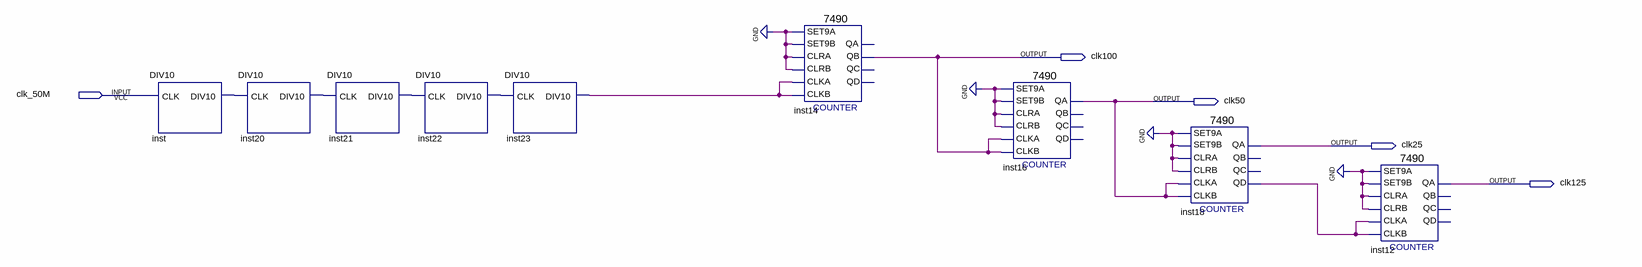
[diagram p0: schematic sheet]
// Quartus schematic DIV_SIM.bdf as structural Verilog: 9 symbols, 5 pins
module DIV_SIM (
  input  clk_50M,
  output clk100,
  output clk50,
  output clk25,
  output clk125
);

  wire inst18_qd, inst20_div10, inst21_div10, inst22_div10, inst23_div10, inst_div10;

  DIV10 inst (.CLK(clk_50M), .DIV10(inst_div10));
  DIV10 inst20 (.CLK(inst_div10), .DIV10(inst20_div10));
  DIV10 inst21 (.CLK(inst20_div10), .DIV10(inst21_div10));
  DIV10 inst22 (.CLK(inst21_div10), .DIV10(inst22_div10));
  DIV10 inst23 (.CLK(inst22_div10), .DIV10(inst23_div10));
  \7490  inst14 (
    .SET9A(1'b0), .CLRA(1'b0), .SET9B(1'b0), .CLKB(inst23_div10), .CLKA(inst23_div10), .CLRB(1'b0),
    .QB(clk100));  // open: QD, QA, QC
  \7490  inst16 (
    .SET9A(1'b0), .CLRA(1'b0), .SET9B(1'b0), .CLKB(clk100), .CLKA(clk100), .CLRB(1'b0), .QA(clk50));  // open: QD, QB, QC
  \7490  inst18 (
    .SET9A(1'b0), .CLRA(1'b0), .SET9B(1'b0), .CLKB(clk50), .CLKA(clk50), .CLRB(1'b0), .QD(inst18_qd),
    .QA(clk25));  // open: QB, QC
  \7490  inst12 (
    .SET9A(1'b0), .CLRA(1'b0), .SET9B(1'b0), .CLKB(inst18_qd), .CLKA(inst18_qd), .CLRB(1'b0), .QA(clk125));  // open: QD, QB, QC
endmodule
